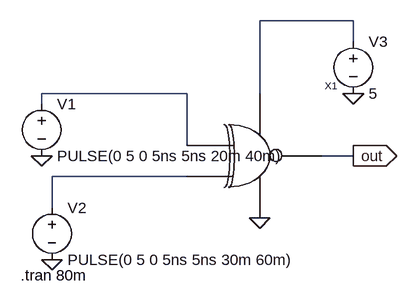
[diagram p0: schematic xnorimplytest.asc]
xnorimplytest.asc, the LTspice schematic file:
Version 4
SHEET 1 880 680
WIRE 384 -32 240 -32
WIRE 384 0 384 -32
WIRE 128 80 -96 80
WIRE 240 80 240 -32
WIRE -96 96 -96 80
WIRE 128 160 128 80
WIRE 384 176 336 176
WIRE 128 208 -80 208
WIRE -80 256 -80 208
FLAG -96 176 0
FLAG -80 336 0
FLAG 384 80 0
FLAG 240 272 0
FLAG 384 176 out
IOPIN 384 176 Out
SYMBOL xnorimply 144 160 R0
SYMATTR InstName X1
SYMBOL voltage -96 80 R0
WINDOW 123 0 0 Left 0
WINDOW 39 0 0 Left 0
SYMATTR InstName V1
SYMATTR Value PULSE(0 5 0 5ns 5ns 20m 40m)
SYMBOL voltage -80 240 R0
WINDOW 123 0 0 Left 0
WINDOW 39 0 0 Left 0
SYMATTR InstName V2
SYMATTR Value PULSE(0 5 0 5ns 5ns 30m 60m)
SYMBOL voltage 384 -16 R0
WINDOW 123 0 0 Left 0
WINDOW 39 0 0 Left 0
SYMATTR InstName V3
SYMATTR Value 5
TEXT -128 360 Left 2 !.tran 80m

The netlist it stands for:
* xnorimplytest.asc
XX1 N002 N003 out N001 0 xnorimply  ; pins A B OUT VDD VSS
V1 N002 0 PULSE(0 5 0 5ns 5ns 20m 40m)
V2 N003 0 PULSE(0 5 0 5ns 5ns 30m 60m)
V3 N001 0 5
.tran 80m
.backanno
.end